# Altium project ZYNQ7000_Core_V1.1.PrjPcb (part 2 of 2)
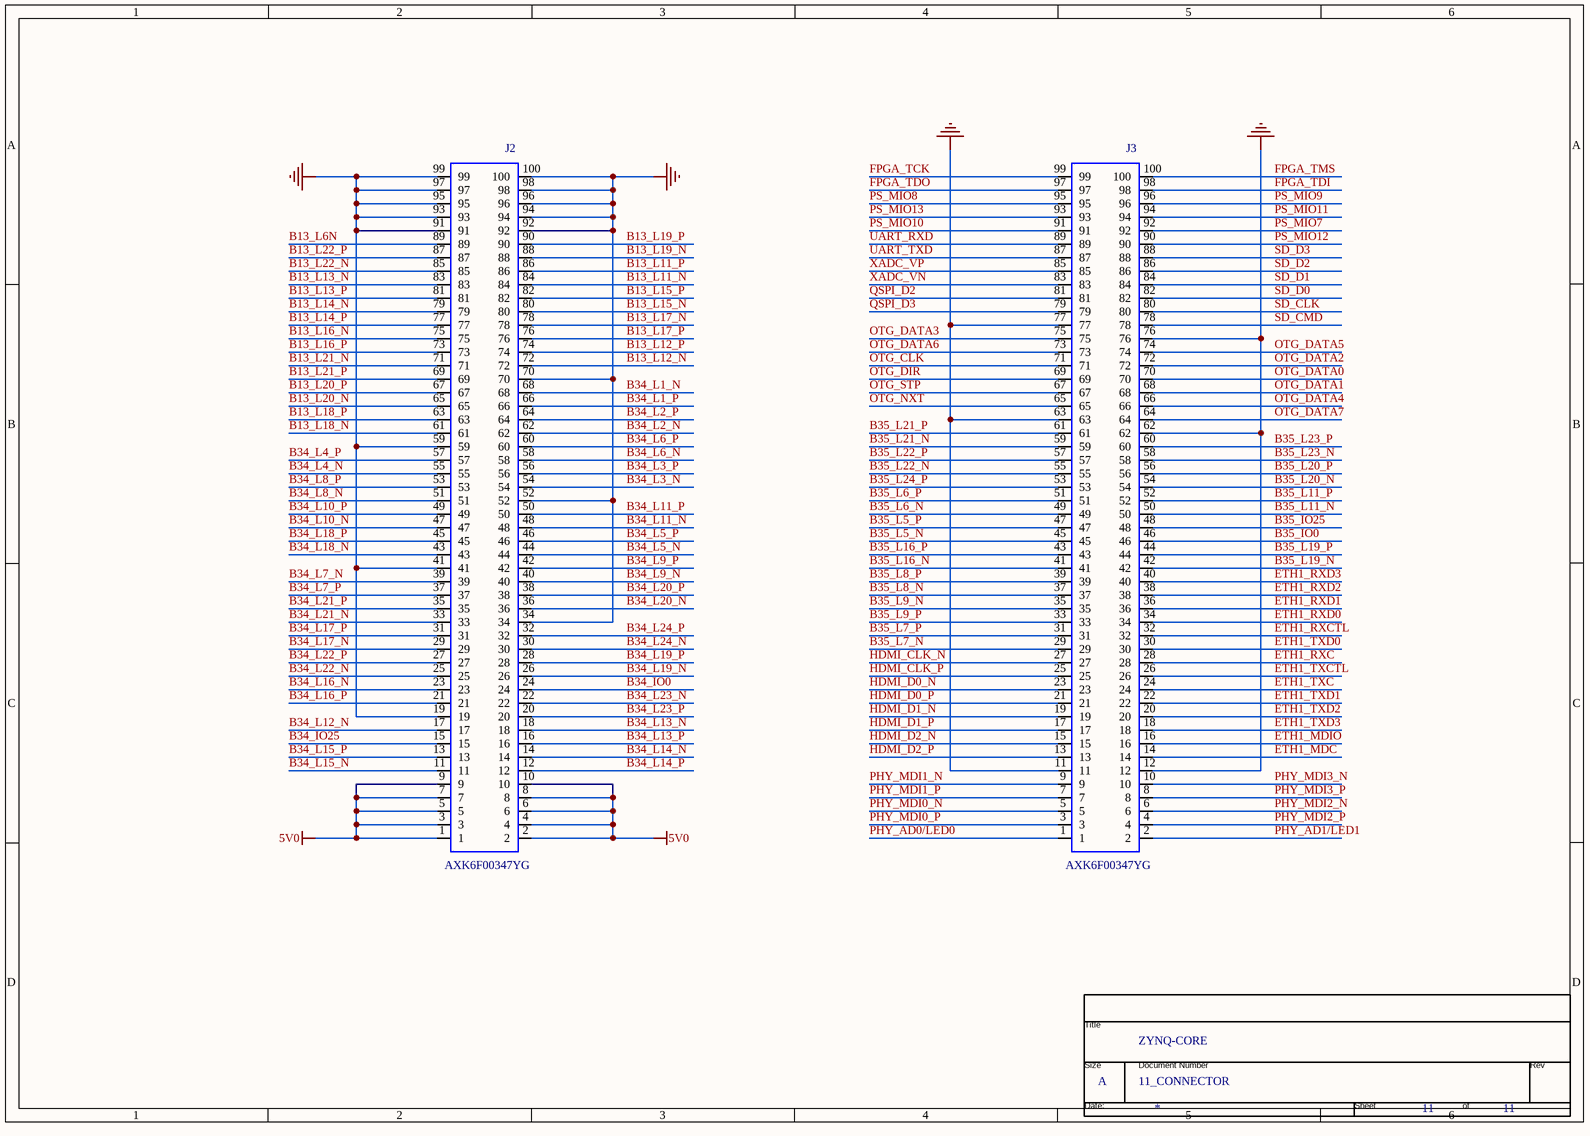
[diagram p11: 11_CONNECTOR.SchDoc]

## Nets that join several sheets
1V0: 06_FPGA POWER (37 pins), 09_POWER (6 pins)
1V8: 02_FPGA Bank0 (L1.2 U1.F11), 04_FPGA Bank500_Bank501 (R20.1 R25.2), 06_FPGA POWER (32 pins), 08_eMMC (15 pins), 09_POWER (7 pins)
1V35: 05_FPGA Bank502 (R27.2), 06_FPGA POWER (22 pins), 07_DDR3 (84 pins), 09_POWER (6 pins)
3V3: 02_FPGA Bank0 (9 pins), 03_Bank13_Bank34_Bank35 (C3.1 X1.1 X1.4), 04_FPGA Bank500_Bank501 (9 pins), 06_FPGA POWER (34 pins), 07_DDR3 (5 pins), 08_eMMC (11 pins), 09_POWER (7 pins), 10_Ethernet-YT8521SC_CA (R203.1 R204.1 R213.1)
5V0: 09_POWER (20 pins), 11_CONNECTOR (10 pins)
GND: 02_FPGA Bank0 (9 pins), 03_Bank13_Bank34_Bank35 (C3.2 R8.2 X1.2), 04_FPGA Bank500_Bank501 (13 pins), 05_FPGA Bank502 (R26.2), 06_FPGA POWER (141 pins), 07_DDR3 (113 pins), 08_eMMC (21 pins), 09_POWER (40 pins), 10_Ethernet-YT8521SC_CA (23 pins), 11_CONNECTOR (22 pins)
VCCIO: 06_FPGA POWER (15 pins), 09_POWER (C162.1 C163.1 U8.5)
VTTREF: 06_FPGA POWER (C87.1 C88.1 U1.H6 U1.P6), 07_DDR3 (15 pins)
B13_L6N: 03_Bank13_Bank34_Bank35 (U1.V5), 11_CONNECTOR (J2.89)
B13_L11_N: 03_Bank13_Bank34_Bank35 (U1.V7), 11_CONNECTOR (J2.84)
B13_L11_P: 03_Bank13_Bank34_Bank35 (U1.U7), 11_CONNECTOR (J2.86)
B13_L12_N: 03_Bank13_Bank34_Bank35 (U1.U10), 11_CONNECTOR (J2.72)
B13_L12_P: 03_Bank13_Bank34_Bank35 (U1.T9), 11_CONNECTOR (J2.74)
B13_L13_N: 03_Bank13_Bank34_Bank35 (U1.Y6), 11_CONNECTOR (J2.83)
B13_L13_P: 03_Bank13_Bank34_Bank35 (U1.Y7), 11_CONNECTOR (J2.81)
B13_L14_N: 03_Bank13_Bank34_Bank35 (U1.Y8), 11_CONNECTOR (J2.79)
B13_L14_P: 03_Bank13_Bank34_Bank35 (U1.Y9), 11_CONNECTOR (J2.77)
B13_L15_N: 03_Bank13_Bank34_Bank35 (U1.W8), 11_CONNECTOR (J2.80)
B13_L15_P: 03_Bank13_Bank34_Bank35 (U1.V8), 11_CONNECTOR (J2.82)
B13_L16_N: 03_Bank13_Bank34_Bank35 (U1.W9), 11_CONNECTOR (J2.75)
B13_L16_P: 03_Bank13_Bank34_Bank35 (U1.W10), 11_CONNECTOR (J2.73)
B13_L17_N: 03_Bank13_Bank34_Bank35 (U1.U8), 11_CONNECTOR (J2.78)
B13_L17_P: 03_Bank13_Bank34_Bank35 (U1.U9), 11_CONNECTOR (J2.76)
B13_L18_N: 03_Bank13_Bank34_Bank35 (U1.Y11), 11_CONNECTOR (J2.61)
B13_L18_P: 03_Bank13_Bank34_Bank35 (U1.W11), 11_CONNECTOR (J2.63)
B13_L19_N: 03_Bank13_Bank34_Bank35 (U1.U5), 11_CONNECTOR (J2.88)
B13_L19_P: 03_Bank13_Bank34_Bank35 (U1.T5), 11_CONNECTOR (J2.90)
B13_L20_N: 03_Bank13_Bank34_Bank35 (U1.Y13), 11_CONNECTOR (J2.65)
B13_L20_P: 03_Bank13_Bank34_Bank35 (U1.Y12), 11_CONNECTOR (J2.67)
B13_L21_N: 03_Bank13_Bank34_Bank35 (U1.V10), 11_CONNECTOR (J2.71)
B13_L21_P: 03_Bank13_Bank34_Bank35 (U1.V11), 11_CONNECTOR (J2.69)
B13_L22_N: 03_Bank13_Bank34_Bank35 (U1.W6), 11_CONNECTOR (J2.85)
B13_L22_P: 03_Bank13_Bank34_Bank35 (U1.V6), 11_CONNECTOR (J2.87)
B34_IO0: 03_Bank13_Bank34_Bank35 (U1.R19), 11_CONNECTOR (J2.24)
B34_IO25: 03_Bank13_Bank34_Bank35 (U1.T19), 11_CONNECTOR (J2.15)
B34_L1_N: 03_Bank13_Bank34_Bank35 (U1.T10), 11_CONNECTOR (J2.68)
B34_L1_P: 03_Bank13_Bank34_Bank35 (U1.T11), 11_CONNECTOR (J2.66)
B34_L2_N: 03_Bank13_Bank34_Bank35 (U1.U12), 11_CONNECTOR (J2.62)
B34_L2_P: 03_Bank13_Bank34_Bank35 (U1.T12), 11_CONNECTOR (J2.64)
B34_L3_N: 03_Bank13_Bank34_Bank35 (U1.V13), 11_CONNECTOR (J2.54)
B34_L3_P: 03_Bank13_Bank34_Bank35 (R8.1 U1.U13), 11_CONNECTOR (J2.56)
B34_L4_N: 03_Bank13_Bank34_Bank35 (U1.W13), 11_CONNECTOR (J2.55)
B34_L4_P: 03_Bank13_Bank34_Bank35 (U1.V12), 11_CONNECTOR (J2.57)
B34_L5_N: 03_Bank13_Bank34_Bank35 (U1.T15), 11_CONNECTOR (J2.44)
B34_L5_P: 03_Bank13_Bank34_Bank35 (U1.T14), 11_CONNECTOR (J2.46)
B34_L6_N: 03_Bank13_Bank34_Bank35 (U1.R14), 11_CONNECTOR (J2.58)
B34_L6_P: 03_Bank13_Bank34_Bank35 (U1.P14), 11_CONNECTOR (J2.60)
B34_L7_N: 03_Bank13_Bank34_Bank35 (U1.Y17), 11_CONNECTOR (J2.39)
B34_L7_P: 03_Bank13_Bank34_Bank35 (U1.Y16), 11_CONNECTOR (J2.37)
B34_L8_N: 03_Bank13_Bank34_Bank35 (U1.Y14), 11_CONNECTOR (J2.51)
B34_L8_P: 03_Bank13_Bank34_Bank35 (U1.W14), 11_CONNECTOR (J2.53)
B34_L9_N: 03_Bank13_Bank34_Bank35 (U1.U17), 11_CONNECTOR (J2.40)
B34_L9_P: 03_Bank13_Bank34_Bank35 (U1.T16), 11_CONNECTOR (J2.42)
B34_L10_N: 03_Bank13_Bank34_Bank35 (U1.W15), 11_CONNECTOR (J2.47)
B34_L10_P: 03_Bank13_Bank34_Bank35 (U1.V15), 11_CONNECTOR (J2.49)
B34_L11_N: 03_Bank13_Bank34_Bank35 (U1.U15), 11_CONNECTOR (J2.48)
B34_L11_P: 03_Bank13_Bank34_Bank35 (U1.U14), 11_CONNECTOR (J2.50)
B34_L12_N: 03_Bank13_Bank34_Bank35 (U1.U19), 11_CONNECTOR (J2.17)
B34_L13_N: 03_Bank13_Bank34_Bank35 (U1.P19), 11_CONNECTOR (J2.18)
B34_L13_P: 03_Bank13_Bank34_Bank35 (U1.N18), 11_CONNECTOR (J2.16)
B34_L14_N: 03_Bank13_Bank34_Bank35 (U1.P20), 11_CONNECTOR (J2.14)
B34_L14_P: 03_Bank13_Bank34_Bank35 (U1.N20), 11_CONNECTOR (J2.12)
B34_L15_N: 03_Bank13_Bank34_Bank35 (U1.U20), 11_CONNECTOR (J2.11)
B34_L15_P: 03_Bank13_Bank34_Bank35 (U1.T20), 11_CONNECTOR (J2.13)
B34_L16_N: 03_Bank13_Bank34_Bank35 (U1.W20), 11_CONNECTOR (J2.23)
B34_L16_P: 03_Bank13_Bank34_Bank35 (U1.V20), 11_CONNECTOR (J2.21)
B34_L17_N: 03_Bank13_Bank34_Bank35 (U1.Y19), 11_CONNECTOR (J2.29)
B34_L17_P: 03_Bank13_Bank34_Bank35 (U1.Y18), 11_CONNECTOR (J2.31)
B34_L18_N: 03_Bank13_Bank34_Bank35 (U1.W16), 11_CONNECTOR (J2.43)
B34_L18_P: 03_Bank13_Bank34_Bank35 (U1.V16), 11_CONNECTOR (J2.45)
B34_L19_N: 03_Bank13_Bank34_Bank35 (U1.R17), 11_CONNECTOR (J2.26)
B34_L19_P: 03_Bank13_Bank34_Bank35 (U1.R16), 11_CONNECTOR (J2.28)
B34_L20_N: 03_Bank13_Bank34_Bank35 (U1.R18), 11_CONNECTOR (J2.36)
B34_L20_P: 03_Bank13_Bank34_Bank35 (U1.T17), 11_CONNECTOR (J2.38)
B34_L21_N: 03_Bank13_Bank34_Bank35 (U1.V18), 11_CONNECTOR (J2.33)
B34_L21_P: 03_Bank13_Bank34_Bank35 (U1.V17), 11_CONNECTOR (J2.35)
B34_L22_N: 03_Bank13_Bank34_Bank35 (U1.W19), 11_CONNECTOR (J2.25)
B34_L22_P: 03_Bank13_Bank34_Bank35 (U1.W18), 11_CONNECTOR (J2.27)
B34_L23_N: 03_Bank13_Bank34_Bank35 (U1.P18), 11_CONNECTOR (J2.22)
B34_L23_P: 03_Bank13_Bank34_Bank35 (U1.N17), 11_CONNECTOR (J2.20)
B34_L24_N: 03_Bank13_Bank34_Bank35 (U1.P16), 11_CONNECTOR (J2.30)
B34_L24_P: 03_Bank13_Bank34_Bank35 (U1.P15), 11_CONNECTOR (J2.32)
B35_IO0: 03_Bank13_Bank34_Bank35 (U1.G14), 11_CONNECTOR (J3.46)
B35_IO25: 03_Bank13_Bank34_Bank35 (U1.J15), 11_CONNECTOR (J3.48)
B35_L5_N: 03_Bank13_Bank34_Bank35 (U1.E19), 11_CONNECTOR (J3.45)
B35_L5_P: 03_Bank13_Bank34_Bank35 (U1.E18), 11_CONNECTOR (J3.47)
B35_L6_N: 03_Bank13_Bank34_Bank35 (U1.F17), 11_CONNECTOR (J3.49)
B35_L6_P: 03_Bank13_Bank34_Bank35 (U1.F16), 11_CONNECTOR (J3.51)
B35_L7_N: 03_Bank13_Bank34_Bank35 (U1.M20), 11_CONNECTOR (J3.29)
B35_L7_P: 03_Bank13_Bank34_Bank35 (U1.M19), 11_CONNECTOR (J3.31)
B35_L8_N: 03_Bank13_Bank34_Bank35 (U1.M18), 11_CONNECTOR (J3.37)
B35_L8_P: 03_Bank13_Bank34_Bank35 (U1.M17), 11_CONNECTOR (J3.39)
B35_L9_N: 03_Bank13_Bank34_Bank35 (U1.L20), 11_CONNECTOR (J3.35)
B35_L9_P: 03_Bank13_Bank34_Bank35 (U1.L19), 11_CONNECTOR (J3.33)
B35_L11_N: 03_Bank13_Bank34_Bank35 (U1.L17), 11_CONNECTOR (J3.50)
B35_L11_P: 03_Bank13_Bank34_Bank35 (U1.L16), 11_CONNECTOR (J3.52)
B35_L16_N: 03_Bank13_Bank34_Bank35 (U1.G18), 11_CONNECTOR (J3.41)
B35_L16_P: 03_Bank13_Bank34_Bank35 (U1.G17), 11_CONNECTOR (J3.43)
B35_L19_N: 03_Bank13_Bank34_Bank35 (U1.G15), 11_CONNECTOR (J3.42)
B35_L19_P: 03_Bank13_Bank34_Bank35 (U1.H15), 11_CONNECTOR (J3.44)
B35_L20_N: 03_Bank13_Bank34_Bank35 (U1.J14), 11_CONNECTOR (J3.54)
B35_L20_P: 03_Bank13_Bank34_Bank35 (U1.K14), 11_CONNECTOR (J3.56)
B35_L21_N: 03_Bank13_Bank34_Bank35 (U1.N16), 11_CONNECTOR (J3.59)
B35_L21_P: 03_Bank13_Bank34_Bank35 (U1.N15), 11_CONNECTOR (J3.61)
B35_L22_N: 03_Bank13_Bank34_Bank35 (U1.L15), 11_CONNECTOR (J3.55)
B35_L22_P: 03_Bank13_Bank34_Bank35 (U1.L14), 11_CONNECTOR (J3.57)
B35_L23_N: 03_Bank13_Bank34_Bank35 (U1.M15), 11_CONNECTOR (J3.58)
B35_L23_P: 03_Bank13_Bank34_Bank35 (U1.M14), 11_CONNECTOR (J3.60)
B35_L24_P: 03_Bank13_Bank34_Bank35 (U1.K16), 11_CONNECTOR (J3.53)
DDR3_A0: 05_FPGA Bank502 (U1.N2), 07_DDR3 (R29.2 U3.N3 U4.N3)
DDR3_A1: 05_FPGA Bank502 (U1.K2), 07_DDR3 (R30.2 U3.P7 U4.P7)
DDR3_A2: 05_FPGA Bank502 (U1.M3), 07_DDR3 (R31.2 U3.P3 U4.P3)
DDR3_A3: 05_FPGA Bank502 (U1.K3), 07_DDR3 (R32.2 U3.N2 U4.N2)
DDR3_A4: 05_FPGA Bank502 (U1.M4), 07_DDR3 (R28.2 U3.P8 U4.P8)
DDR3_A5: 05_FPGA Bank502 (U1.L1), 07_DDR3 (R33.2 U3.P2 U4.P2)
DDR3_A6: 05_FPGA Bank502 (U1.L4), 07_DDR3 (R34.2 U3.R8 U4.R8)
DDR3_A7: 05_FPGA Bank502 (U1.K4), 07_DDR3 (R35.2 U3.R2 U4.R2)
DDR3_A8: 05_FPGA Bank502 (U1.K1), 07_DDR3 (R36.2 U3.T8 U4.T8)
DDR3_A9: 05_FPGA Bank502 (U1.J4), 07_DDR3 (R37.2 U3.R3 U4.R3)
DDR3_A10: 05_FPGA Bank502 (U1.F5), 07_DDR3 (R38.2 U3.L7 U4.L7)
DDR3_A11: 05_FPGA Bank502 (U1.G4), 07_DDR3 (R39.2 U3.R7 U4.R7)
DDR3_A12: 05_FPGA Bank502 (U1.E4), 07_DDR3 (R40.2 U3.N7 U4.N7)
DDR3_A13: 05_FPGA Bank502 (U1.D4), 07_DDR3 (R41.2 U3.T3 U4.T3)
DDR3_A14: 05_FPGA Bank502 (U1.F4), 07_DDR3 (R42.2 U3.T7 U4.T7)
DDR3_BA0: 05_FPGA Bank502 (U1.L5), 07_DDR3 (R43.2 U3.M2 U4.M2)
DDR3_BA1: 05_FPGA Bank502 (U1.R4), 07_DDR3 (R46.2 U3.N8 U4.N8)
DDR3_BA2: 05_FPGA Bank502 (U1.J5), 07_DDR3 (R47.2 U3.M3 U4.M3)
DDR3_CAS: 05_FPGA Bank502 (U1.P5), 07_DDR3 (R51.2 U3.K3 U4.K3)
DDR3_CKE: 05_FPGA Bank502 (U1.N3), 07_DDR3 (R54.2 U3.K9 U4.K9)
DDR3_CLK0_N: 05_FPGA Bank502 (U1.M2), 07_DDR3 (R55.1 U3.K7 U4.K7)
DDR3_CLK0_P: 05_FPGA Bank502 (U1.L2), 07_DDR3 (R55.2 U3.J7 U4.J7)
DDR3_D0: 05_FPGA Bank502 (U1.C3), 07_DDR3 (U4.F8)
DDR3_D1: 05_FPGA Bank502 (U1.B3), 07_DDR3 (U4.G2)
DDR3_D2: 05_FPGA Bank502 (U1.A2), 07_DDR3 (U4.F2)
DDR3_D3: 05_FPGA Bank502 (U1.A4), 07_DDR3 (U4.H3)
DDR3_D4: 05_FPGA Bank502 (U1.D3), 07_DDR3 (U4.H8)
DDR3_D5: 05_FPGA Bank502 (U1.D1), 07_DDR3 (U4.F7)
DDR3_D6: 05_FPGA Bank502 (U1.C1), 07_DDR3 (U4.E3)
DDR3_D7: 05_FPGA Bank502 (U1.E1), 07_DDR3 (U4.H7)
DDR3_D8: 05_FPGA Bank502 (U1.E2), 07_DDR3 (U4.C3)
DDR3_D9: 05_FPGA Bank502 (U1.E3), 07_DDR3 (U4.C2)
DDR3_D10: 05_FPGA Bank502 (U1.G3), 07_DDR3 (U4.A3)
DDR3_D11: 05_FPGA Bank502 (U1.H3), 07_DDR3 (U4.A2)
DDR3_D12: 05_FPGA Bank502 (U1.J3), 07_DDR3 (U4.C8)
DDR3_D13: 05_FPGA Bank502 (U1.H2), 07_DDR3 (U4.A7)
DDR3_D14: 05_FPGA Bank502 (U1.H1), 07_DDR3 (U4.D7)
DDR3_D15: 05_FPGA Bank502 (U1.J1), 07_DDR3 (U4.B8)
DDR3_D16: 05_FPGA Bank502 (U1.P1), 07_DDR3 (U3.E3)
DDR3_D17: 05_FPGA Bank502 (U1.P3), 07_DDR3 (U3.F2)
DDR3_D18: 05_FPGA Bank502 (U1.R3), 07_DDR3 (U3.G2)
DDR3_D19: 05_FPGA Bank502 (U1.R1), 07_DDR3 (U3.H3)
DDR3_D20: 05_FPGA Bank502 (U1.T4), 07_DDR3 (U3.H7)
DDR3_D21: 05_FPGA Bank502 (U1.U4), 07_DDR3 (U3.H8)
DDR3_D22: 05_FPGA Bank502 (U1.U2), 07_DDR3 (U3.F7)
DDR3_D23: 05_FPGA Bank502 (U1.U3), 07_DDR3 (U3.F8)
DDR3_D24: 05_FPGA Bank502 (U1.V1), 07_DDR3 (U3.A3)
DDR3_D25: 05_FPGA Bank502 (U1.Y3), 07_DDR3 (U3.C8)
DDR3_D26: 05_FPGA Bank502 (U1.W1), 07_DDR3 (U3.C3)
DDR3_D27: 05_FPGA Bank502 (U1.Y4), 07_DDR3 (U3.A7)
DDR3_D28: 05_FPGA Bank502 (U1.Y2), 07_DDR3 (U3.D7)
DDR3_D29: 05_FPGA Bank502 (U1.W3), 07_DDR3 (U3.B8)
DDR3_D30: 05_FPGA Bank502 (U1.V2), 07_DDR3 (U3.A2)
DDR3_D31: 05_FPGA Bank502 (U1.V3), 07_DDR3 (U3.C2)
DDR3_DM0: 05_FPGA Bank502 (U1.A1), 07_DDR3 (U4.E7)
DDR3_DM1: 05_FPGA Bank502 (U1.F1), 07_DDR3 (U4.D3)
DDR3_DM2: 05_FPGA Bank502 (U1.T1), 07_DDR3 (U3.E7)
DDR3_DM3: 05_FPGA Bank502 (U1.Y1), 07_DDR3 (U3.D3)
DDR3_DQS0_N: 05_FPGA Bank502 (U1.B2), 07_DDR3 (U4.G3)
DDR3_DQS0_P: 05_FPGA Bank502 (U1.C2), 07_DDR3 (U4.F3)
DDR3_DQS1_N: 05_FPGA Bank502 (U1.F2), 07_DDR3 (U4.B7)
DDR3_DQS1_P: 05_FPGA Bank502 (U1.G2), 07_DDR3 (U4.C7)
DDR3_DQS2_N: 05_FPGA Bank502 (U1.T2), 07_DDR3 (U3.G3)
DDR3_DQS2_P: 05_FPGA Bank502 (U1.R2), 07_DDR3 (U3.F3)
DDR3_DQS3_N: 05_FPGA Bank502 (U1.W4), 07_DDR3 (U3.B7)
DDR3_DQS3_P: 05_FPGA Bank502 (U1.W5), 07_DDR3 (U3.C7)
DDR3_ODT: 05_FPGA Bank502 (U1.N5), 07_DDR3 (R53.2 U3.K1 U4.K1)
DDR3_RAS: 05_FPGA Bank502 (U1.P4), 07_DDR3 (R50.2 U3.J3 U4.J3)
DDR3_RESET: 05_FPGA Bank502 (U1.B4), 07_DDR3 (R49.1 U3.T2 U4.T2)
DDR3_S0: 05_FPGA Bank502 (U1.N1), 07_DDR3 (R48.2 U3.L2 U4.L2)
DDR3_WE: 05_FPGA Bank502 (U1.M5), 07_DDR3 (R52.2 U3.L3 U4.L3)
ETH1_MDC: 03_Bank13_Bank34_Bank35 (U1.F20), 11_CONNECTOR (J3.14)
ETH1_MDIO: 03_Bank13_Bank34_Bank35 (U1.F19), 11_CONNECTOR (J3.16)
ETH1_RXC: 03_Bank13_Bank34_Bank35 (U1.K17), 11_CONNECTOR (J3.28)
ETH1_RXCTL: 03_Bank13_Bank34_Bank35 (U1.E17), 11_CONNECTOR (J3.32)
ETH1_RXD0: 03_Bank13_Bank34_Bank35 (U1.B19), 11_CONNECTOR (J3.34)
ETH1_RXD1: 03_Bank13_Bank34_Bank35 (U1.A20), 11_CONNECTOR (J3.36)
ETH1_RXD2: 03_Bank13_Bank34_Bank35 (U1.H17), 11_CONNECTOR (J3.38)
ETH1_RXD3: 03_Bank13_Bank34_Bank35 (U1.H16), 11_CONNECTOR (J3.40)
ETH1_TXC: 03_Bank13_Bank34_Bank35 (U1.B20), 11_CONNECTOR (J3.24)
ETH1_TXCTL: 03_Bank13_Bank34_Bank35 (U1.K18), 11_CONNECTOR (J3.26)
ETH1_TXD0: 03_Bank13_Bank34_Bank35 (U1.D18), 11_CONNECTOR (J3.30)
ETH1_TXD1: 03_Bank13_Bank34_Bank35 (U1.C20), 11_CONNECTOR (J3.22)
ETH1_TXD2: 03_Bank13_Bank34_Bank35 (U1.D19), 11_CONNECTOR (J3.20)
ETH1_TXD3: 03_Bank13_Bank34_Bank35 (U1.D20), 11_CONNECTOR (J3.18)
ETH_MDC: 04_FPGA Bank500_Bank501 (U1.C10), 10_Ethernet-YT8521SC_CA (U10.14)
ETH_MDIO: 04_FPGA Bank500_Bank501 (U1.C11), 10_Ethernet-YT8521SC_CA (R209.1 U10.15)
ETH_RX_DV: 04_FPGA Bank500_Bank501 (U1.D13), 10_Ethernet-YT8521SC_CA (R214.1 U10.27)
ETH_RXCK: 04_FPGA Bank500_Bank501 (U1.B17), 10_Ethernet-YT8521SC_CA (R207.1 U10.28)
ETH_RXD0: 04_FPGA Bank500_Bank501 (U1.D11), 10_Ethernet-YT8521SC_CA (R205.1 U10.26)
ETH_RXD1: 04_FPGA Bank500_Bank501 (U1.A16), 10_Ethernet-YT8521SC_CA (R211.1 U10.25)
ETH_RXD2: 04_FPGA Bank500_Bank501 (U1.F15), 10_Ethernet-YT8521SC_CA (R212.1 U10.24)
ETH_RXD3: 04_FPGA Bank500_Bank501 (U1.A15), 10_Ethernet-YT8521SC_CA (R210.1 U10.23)
ETH_TXCK: 04_FPGA Bank500_Bank501 (U1.A19), 10_Ethernet-YT8521SC_CA (U10.21)
ETH_TXCTL: 04_FPGA Bank500_Bank501 (U1.F14), 10_Ethernet-YT8521SC_CA (U10.20)
ETH_TXD0: 04_FPGA Bank500_Bank501 (U1.E14), 10_Ethernet-YT8521SC_CA (U10.19)
ETH_TXD1: 04_FPGA Bank500_Bank501 (U1.B18), 10_Ethernet-YT8521SC_CA (U10.18)
ETH_TXD2: 04_FPGA Bank500_Bank501 (U1.D10), 10_Ethernet-YT8521SC_CA (U10.17)
ETH_TXD3: 04_FPGA Bank500_Bank501 (U1.A17), 10_Ethernet-YT8521SC_CA (U10.16)
FPGA_TCK: 02_FPGA Bank0 (J1.3 U1.F9), 11_CONNECTOR (J3.99)
FPGA_TDI: 02_FPGA Bank0 (J1.5 U1.G6), 11_CONNECTOR (J3.98)
FPGA_TDO: 02_FPGA Bank0 (J1.4 U1.F6), 11_CONNECTOR (J3.97)
FPGA_TMS: 02_FPGA Bank0 (J1.6 U1.J6), 11_CONNECTOR (J3.100)
HDMI_CLK_N: 03_Bank13_Bank34_Bank35 (U1.H18), 11_CONNECTOR (J3.27)
HDMI_CLK_P: 03_Bank13_Bank34_Bank35 (U1.J18), 11_CONNECTOR (J3.25)
HDMI_D0_N: 03_Bank13_Bank34_Bank35 (U1.G20), 11_CONNECTOR (J3.23)
HDMI_D0_P: 03_Bank13_Bank34_Bank35 (U1.G19), 11_CONNECTOR (J3.21)
HDMI_D1_N: 03_Bank13_Bank34_Bank35 (U1.J19), 11_CONNECTOR (J3.19)
HDMI_D1_P: 03_Bank13_Bank34_Bank35 (U1.K19), 11_CONNECTOR (J3.17)
HDMI_D2_N: 03_Bank13_Bank34_Bank35 (U1.H20), 11_CONNECTOR (J3.15)
HDMI_D2_P: 03_Bank13_Bank34_Bank35 (U1.J20), 11_CONNECTOR (J3.13)
MIO0_LED: 02_FPGA Bank0 (LED2.1), 04_FPGA Bank500_Bank501 (U1.E6)
MMC_CCLK: 04_FPGA Bank500_Bank501 (R24.2), 08_eMMC (U6.M6)
MMC_CMD: 04_FPGA Bank500_Bank501 (U1.B14), 08_eMMC (R64.2 U6.M5)
MMC_DATA0: 04_FPGA Bank500_Bank501 (U1.D16), 08_eMMC (R63.2 U6.A3)
MMC_DATA1: 04_FPGA Bank500_Bank501 (U1.C12), 08_eMMC (R62.2 U6.A4)
MMC_DATA2: 04_FPGA Bank500_Bank501 (U1.B13), 08_eMMC (R61.2 U6.A5)
MMC_DATA3: 04_FPGA Bank500_Bank501 (U1.B9), 08_eMMC (R60.2 U6.B2)
OTG_CLK: 04_FPGA Bank500_Bank501 (U1.A11), 11_CONNECTOR (J3.71)
OTG_DATA0: 04_FPGA Bank500_Bank501 (U1.A14), 11_CONNECTOR (J3.70)
OTG_DATA1: 04_FPGA Bank500_Bank501 (U1.D15), 11_CONNECTOR (J3.68)
OTG_DATA2: 04_FPGA Bank500_Bank501 (U1.A12), 11_CONNECTOR (J3.72)
OTG_DATA3: 04_FPGA Bank500_Bank501 (U1.F12), 11_CONNECTOR (J3.75)
OTG_DATA4: 04_FPGA Bank500_Bank501 (U1.C16), 11_CONNECTOR (J3.66)
OTG_DATA5: 04_FPGA Bank500_Bank501 (U1.A10), 11_CONNECTOR (J3.74)
OTG_DATA6: 04_FPGA Bank500_Bank501 (U1.E13), 11_CONNECTOR (J3.73)
OTG_DATA7: 04_FPGA Bank500_Bank501 (U1.C18), 11_CONNECTOR (J3.64)
OTG_DIR: 04_FPGA Bank500_Bank501 (U1.C13), 11_CONNECTOR (J3.69)
OTG_NXT: 04_FPGA Bank500_Bank501 (U1.E16), 11_CONNECTOR (J3.65)
OTG_STP: 04_FPGA Bank500_Bank501 (U1.C15), 11_CONNECTOR (J3.67)
PHY_AD0/LED0: 10_Ethernet-YT8521SC_CA (R206.1 U10.36), 11_CONNECTOR (J3.1)
PHY_AD1/LED1: 10_Ethernet-YT8521SC_CA (R208.1 U10.37), 11_CONNECTOR (J3.2)
PHY_MDI0_N: 10_Ethernet-YT8521SC_CA (U10.3), 11_CONNECTOR (J3.5)
PHY_MDI0_P: 10_Ethernet-YT8521SC_CA (U10.2), 11_CONNECTOR (J3.3)
PHY_MDI1_N: 10_Ethernet-YT8521SC_CA (U10.6), 11_CONNECTOR (J3.9)
PHY_MDI1_P: 10_Ethernet-YT8521SC_CA (U10.5), 11_CONNECTOR (J3.7)
PHY_MDI2_N: 10_Ethernet-YT8521SC_CA (U10.8), 11_CONNECTOR (J3.6)
PHY_MDI2_P: 10_Ethernet-YT8521SC_CA (U10.7), 11_CONNECTOR (J3.4)
PHY_MDI3_N: 10_Ethernet-YT8521SC_CA (U10.11), 11_CONNECTOR (J3.10)
PHY_MDI3_P: 10_Ethernet-YT8521SC_CA (U10.10), 11_CONNECTOR (J3.8)
PL_LED: 02_FPGA Bank0 (LED1.1), 03_Bank13_Bank34_Bank35 (U1.J16)
PS_MIO7: 04_FPGA Bank500_Bank501 (R14.2 U1.D8), 11_CONNECTOR (J3.92)
PS_MIO8: 04_FPGA Bank500_Bank501 (R9.2 U1.D5), 11_CONNECTOR (J3.95)
PS_MIO9: 04_FPGA Bank500_Bank501 (U1.B5), 11_CONNECTOR (J3.96)
PS_MIO10: 04_FPGA Bank500_Bank501 (U1.E9), 11_CONNECTOR (J3.91)
PS_MIO11: 04_FPGA Bank500_Bank501 (U1.C6), 11_CONNECTOR (J3.94)
PS_MIO12: 04_FPGA Bank500_Bank501 (U1.D9), 11_CONNECTOR (J3.90)
PS_MIO13: 04_FPGA Bank500_Bank501 (U1.E8), 11_CONNECTOR (J3.93)
PS_POR_B: 04_FPGA Bank500_Bank501 (R22.2 U1.C7 U2.2), 10_Ethernet-YT8521SC_CA (U10.13)
QSPI_CS: 04_FPGA Bank500_Bank501 (U1.A7), 08_eMMC (R59.2 U7.1)
QSPI_D0: 04_FPGA Bank500_Bank501 (R10.2 U1.B8), 08_eMMC (U7.5)
QSPI_D1: 04_FPGA Bank500_Bank501 (R11.2 U1.D6), 08_eMMC (U7.2)
QSPI_D2: 04_FPGA Bank500_Bank501 (R215.2 U1.B7), 08_eMMC (U7.3), 11_CONNECTOR (J3.81)
QSPI_D3: 04_FPGA Bank500_Bank501 (R216.2 U1.A6), 08_eMMC (U7.7), 11_CONNECTOR (J3.79)
QSPI_SCK: 04_FPGA Bank500_Bank501 (R12.2 R13.2), 08_eMMC (U7.6)
SD_CLK: 04_FPGA Bank500_Bank501 (R23.2), 11_CONNECTOR (J3.80)
SD_CMD: 04_FPGA Bank500_Bank501 (U1.C17), 11_CONNECTOR (J3.78)
SD_D0: 04_FPGA Bank500_Bank501 (U1.E12), 11_CONNECTOR (J3.82)
SD_D1: 04_FPGA Bank500_Bank501 (U1.A9), 11_CONNECTOR (J3.84)
SD_D2: 04_FPGA Bank500_Bank501 (U1.F13), 11_CONNECTOR (J3.86)
SD_D3: 04_FPGA Bank500_Bank501 (U1.B15), 11_CONNECTOR (J3.88)
UART_RXD: 04_FPGA Bank500_Bank501 (U1.C5), 11_CONNECTOR (J3.89)
UART_TXD: 04_FPGA Bank500_Bank501 (U1.C8), 11_CONNECTOR (J3.87)
XADC_VN: 02_FPGA Bank0 (U1.L10), 11_CONNECTOR (J3.83)
XADC_VP: 02_FPGA Bank0 (U1.K9), 11_CONNECTOR (J3.85)

## Assembly variants
V01: not fitted C148 J1 NC181 NC183